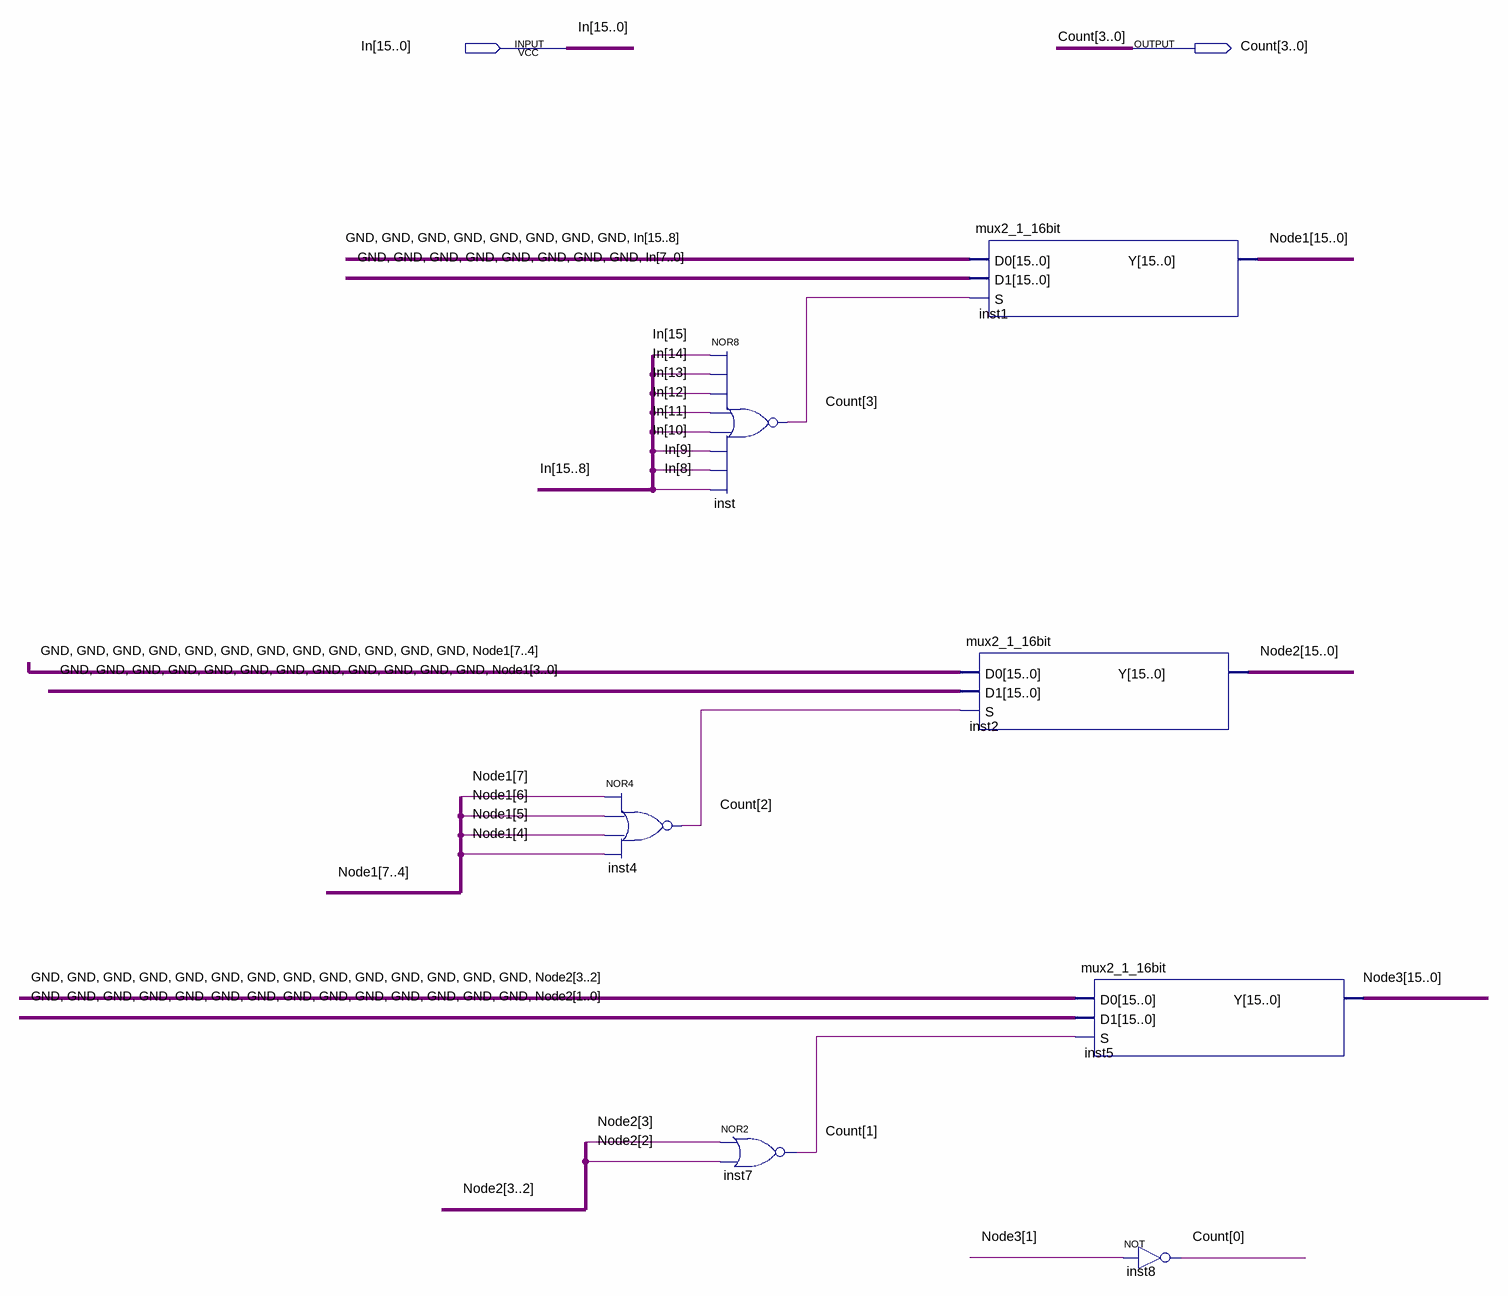
[diagram p0: schematic sheet]
// Quartus schematic detect_zero.bdf as structural Verilog: 7 symbols, 2 pins
module detect_zero (
  input  [15:0] In,
  output [3:0] Count
);

  wire GND;
  wire [15:0] Node1, Node2, Node3;

  nor inst4 (Count[2], Node1[7], Node1[6], Node1[5], Node1[4]);
  nor inst (Count[3], In[15], In[14], In[13], In[12], In[11], In[10], In[9], In[8]);
  nor inst7 (Count[1], Node2[3], Node2[2]);
  mux2_1_16bit inst1 (.D0({{8{GND}}, In[15:8]}), .D1({{8{GND}}, In[7:0]}), .S(Count[3]), .Y(Node1));
  mux2_1_16bit inst2 (.D0({{12{GND}}, Node1[7:4]}), .D1({{12{GND}}, Node1[3:0]}), .S(Count[2]), .Y(Node2));
  mux2_1_16bit inst5 (.D0({{14{GND}}, Node2[3:2]}), .D1({{14{GND}}, Node2[1:0]}), .S(Count[1]), .Y(Node3));
  not inst8 (Count[0], Node3[1]);
endmodule
